# Altium schematic sheet Power.SchDoc
size A; SheetNumber: 5
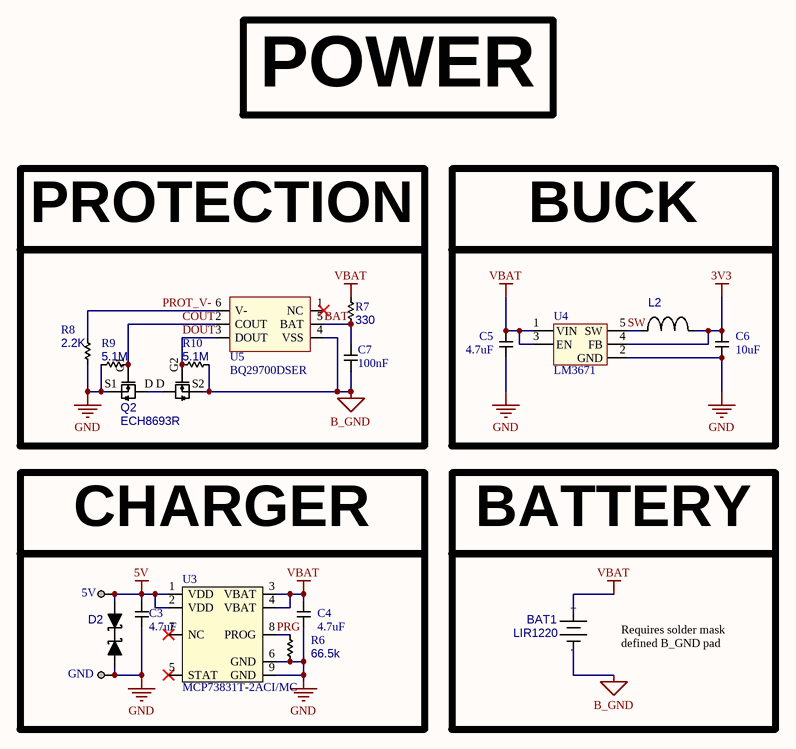
[diagram p0: Power.SchDoc]

## Parts
5V  0.1" Pad  [0.1" Pad]  (value not drawn)  (no BOM)
BAT1  LIR1220  [LIR1220]
C3  4.7uF  [CAP_0402_HIGH]
C4  4.7uF  [CAP_0402_HIGH]
C5  4.7uF  [CAP_0402_HIGH]
C6  10uF  [CAP_0402_HIGH]
C7  100nF  [CAP_0402_HIGH]
D2  D5V0L1B2LP4-7B  [D5V0L1B2LP4-7B]  (value not drawn)
GND  0.1" Pad  [0.1" Pad]  (value not drawn)  (no BOM)
L2  CIGT201610EH2R2MNE  [CIGT201610EH2R2MNE]  (value not drawn)
Q2  ECH8693R  [ECH8693R]
R6  66.5k  [RES_0402_HIGH]
R7  330  [RES_0402_HIGH]
R8  2.2K  [RES_0402_HIGH]
R9  5.1M  [RES_0402_HIGH]
R10  5.1M  [RES_0402_HIGH]
U3  MCP73831T-2ACI/MC  [MCP73831T-2ACI/MC]
U4  LM3671  [LM3671-BGA]
U5  BQ29700DSER  [BQ29700DSER]

## Nets
3V3: C6.2 L2.2 U4.4(FB)
5V: 5V.1 C3.2 D2.1 U3.1(VDD) U3.2(VDD)
B_GND: C7.1 Q2.S2(S) R10.1 U5.4(VSS)
GND: C3.1 C4.1 C5.1 C6.1 D2.2 GND.1 Q2.S1(S) R6.2 R8.1 R9.2 U3.6(GND) U3.9(GND) U4.2(GND)
VBAT: BAT1.1(+) C4.2 C5.2 R7.1 U3.3(VBAT) U3.4(VBAT) U4.1(VIN) U4.3(EN)
BAT: C7.2 R7.2 U5.5(BAT)
COUT: Q2.G1(G) R9.1 U5.2(COUT)
DOUT: Q2.G2(G) R10.2 U5.3(DOUT)
PRG: R6.1 U3.8(PROG)
PROT_V-: R8.2 U5.6(V-)
SW: L2.1 U4.5(SW)

Not connected (* = marked no-connect by the designer): Q2 D; U3 5(STAT)* 7(NC)*; U5 1(NC)*

## Notes on the sheet
- POWER
- PROTECTION
- BUCK
- CHARGER
- BATTERY
- (near BAT1) Requires solder mask
  defined B_GND pad
- (in symbol LIR1220 Batter) -

## Library data of the parts
BAT1 = LIR1220 Batter: LIR1220 Battery
C3-C7 = Capacitor_0402: 0402 Capacitor
D2 = D5V0L1B2LP4-7B: D5V0L1B2LP4-7B 14V Clamp 6A (8/20µs) Ipp Tvs Diode Surface Mount X2-DFN1006-2
L2 = CIGT201610EH2R2MNE: CIGT201610EH2R2MNE 2.2µH Unshielded Thin Film Inductor 2.5A 87mOhm Max 0806 (2016 Metric)
Q2 = ECH8693R: Mosfet Array 2 N-Channel (Dual) Common Drain 24V 14A 1.4W Surface Mount SOT-28FL/ECH8
R6-R10 = Resistor_0402: 0402 Resistor
U3 = MCP73831T-2ACI/MC: MCP73831T-2ACI/MC Charger IC Lithium-Ion/Polymer
U4 = LM3671: LM3671 IC REG BUCK 3.3V 0.6A SYNC 5USMD
U5 = BQ29700DSER: Battery Battery Protection IC Lithium-Ion/Polymer 6-WSON (1.5x1.5)